# EAGLE design keychainlight (EAGLE 6.4)
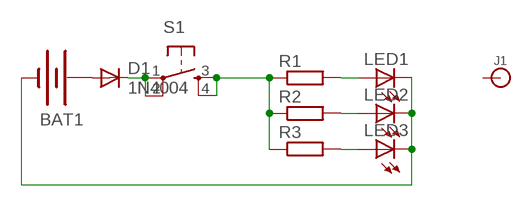
[diagram p0: schematic, sheet 1]

## Parts
BAT1  BATTERY20PTH  [BATTCOM_20MM_PTH]
D1  1N4004  [DO41-10]
J1  BANANA_CONN  [BANANA_CONN]
LED1  LED5MM  [LED5MM]
LED2  LED5MM  [LED5MM]
LED3  LED5MM  [LED5MM]
R1  R-EU_0207/7  [0207/7]
R2  R-EU_0207/7  [0207/7]
R3  R-EU_0207/7  [0207/7]
S1  TAC_SWITCHPTH  [TACTILE-PTH]

## Nets
N$1: BAT1.1(+) D1.A
N$2: D1.C S1.1 S1.2
N$3: LED1.A R1.2
N$4: LED2.A R2.2
N$5: LED3.A R3.2
N$7: BAT1.2(-) LED1.K(C) LED2.K(C) LED3.K(C)
N$8: R1.1 R2.1 R3.1 S1.3 S1.4
Unconnected: J1.P$1

## Library data of the parts
BAT1 = SparkFun-Electromechanical:BATTERY: Battery Holders Various common sizes : AA, AAA, 20mm coin cell and 12mm coin cell. 20MM_4LEGS, BATT-10373
D1 = diode:1N4004: DIODE general purpose rectifier, 1 A
J1 = SparkFun-Connectors:BANANA_CONN: Through-hole banana jack
LED1-LED3 = SparkFun-LED:LED: LEDs Standard schematic elements and footprints for 5mm, 3mm, 1206, and 0603 sized LEDs. 5mm - Spark Fun Electronics SKU : COM-00529 (and others)
R1-R3 = resistor:R-EU_: RESISTOR, European symbol
S1 = SparkFun-Electromechanical:TAC_SWITCH: Momentary Switch Button commonly used for reset or general input. Spark Fun Electronics SKU : COM-00097 SMT- SWCH-08247

## Board
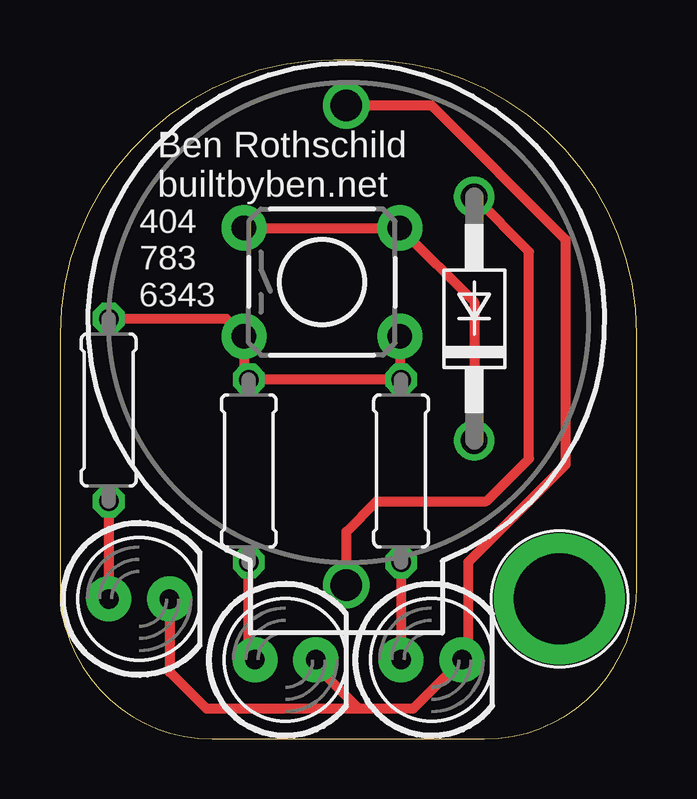
[diagram p1: board, top side]

Size 24.05 x 28.31 mm. Coordinates in mm from the lower left corner, seen from the top.
Outline: 0,16.88 0,6.35 arc90 6.35,0 17.7,0 arc90 24.05,6.35 24.05,16.88 arc90 12.62,28.31 11.43,28.31 arc90 0,16.88
Copper layers (1*16): Top 0.035mm / dielectric 1.5mm / Bottom 0.035mm
Design rules "default": minimum track width 10mil, minimum drill 24mil, track to track 8mil, track to pad 8mil, pad to pad 8mil, via to via 8mil, smd to smd 8mil, copper to edge 40mil, drill to drill 8mil, minimum pad ring 10mil, minimum via ring 8mil, stop-mask expansion 4mil, vias tented up to drill 0mil, thermal gap 10mil

### Footprints (pad centres in the part's own frame; a part is rotated, then mirrored left to right if it is on the bottom)
BATTCOM_20MM_PTH = drill 1.3: 1 20,0; 2 0,0
DO41-10 = drill 1.118: A 5.08,0; C -5.08,0
BANANA_CONN = drill 3.81 pad 5.461: P$1 0,0
LED5MM = drill 0.813 pad 1.88: A -1.27,0; K 1.27,0
0207/7 = drill 0.813 octagon: 1 -3.81,0; 2 3.81,0
TACTILE-PTH = drill 1.016 pad 1.88: 1 -3.251,2.261; 2 3.251,2.261; 3 -3.251,-2.261; 4 3.251,-2.261

### Placement (x,y rotation side)
BAT1  11.94,26.42 270 top
D1  17.27,17.53 90 top
J1  20.83,5.84 0 top
LED1  9.4,3.3 0 top
LED2  15.49,3.3 0 top
LED3  3.3,5.84 0 top
R1  7.87,11.18 270 top
R2  14.22,11.18 270 top
R3  2.03,13.72 270 top
S1  10.92,19.05 0 top

### Tracks (layer width: path | path; a pad name or v marks a point on that pad's centre or on a via)
N$1
  Top 0.406: BAT1.1 11.94,8.64 13.21,9.91 17.78,9.91 19.56,11.68 19.56,20.32 D1.A
N$2
  Top 0.406: S1.1 S1.2 17.27,18.21 D1.C
N$3
  Top 0.406: LED1.A 7.87,3.56 R1.2
N$4
  Top 0.406: R2.2 LED2.A
N$5
  Top 0.406: R3.2 LED3.A
N$7
  Top 0.406: LED3.K 4.57,2.79 6.1,1.27 12.45,1.27 | 12.45,1.27 14.73,1.27 LED2.K 17.02,3.56 17.02,7.37 21.08,11.43 21.08,20.83 15.49,26.42 BAT1.2 | LED1.K 10.67,3.05 12.45,1.27
N$8
  Top 0.406: R3.1 6.93,17.53 S1.3 7.67,15.19 R1.1 R2.1 14.17,15.04 S1.4

### Text on the board
tPlace: Ben Rothschild / builtbyben.net | 404 / 783 / 6343